# EAGLE design Othello (EAGLE 5.11)

## Sheet 1 of 2
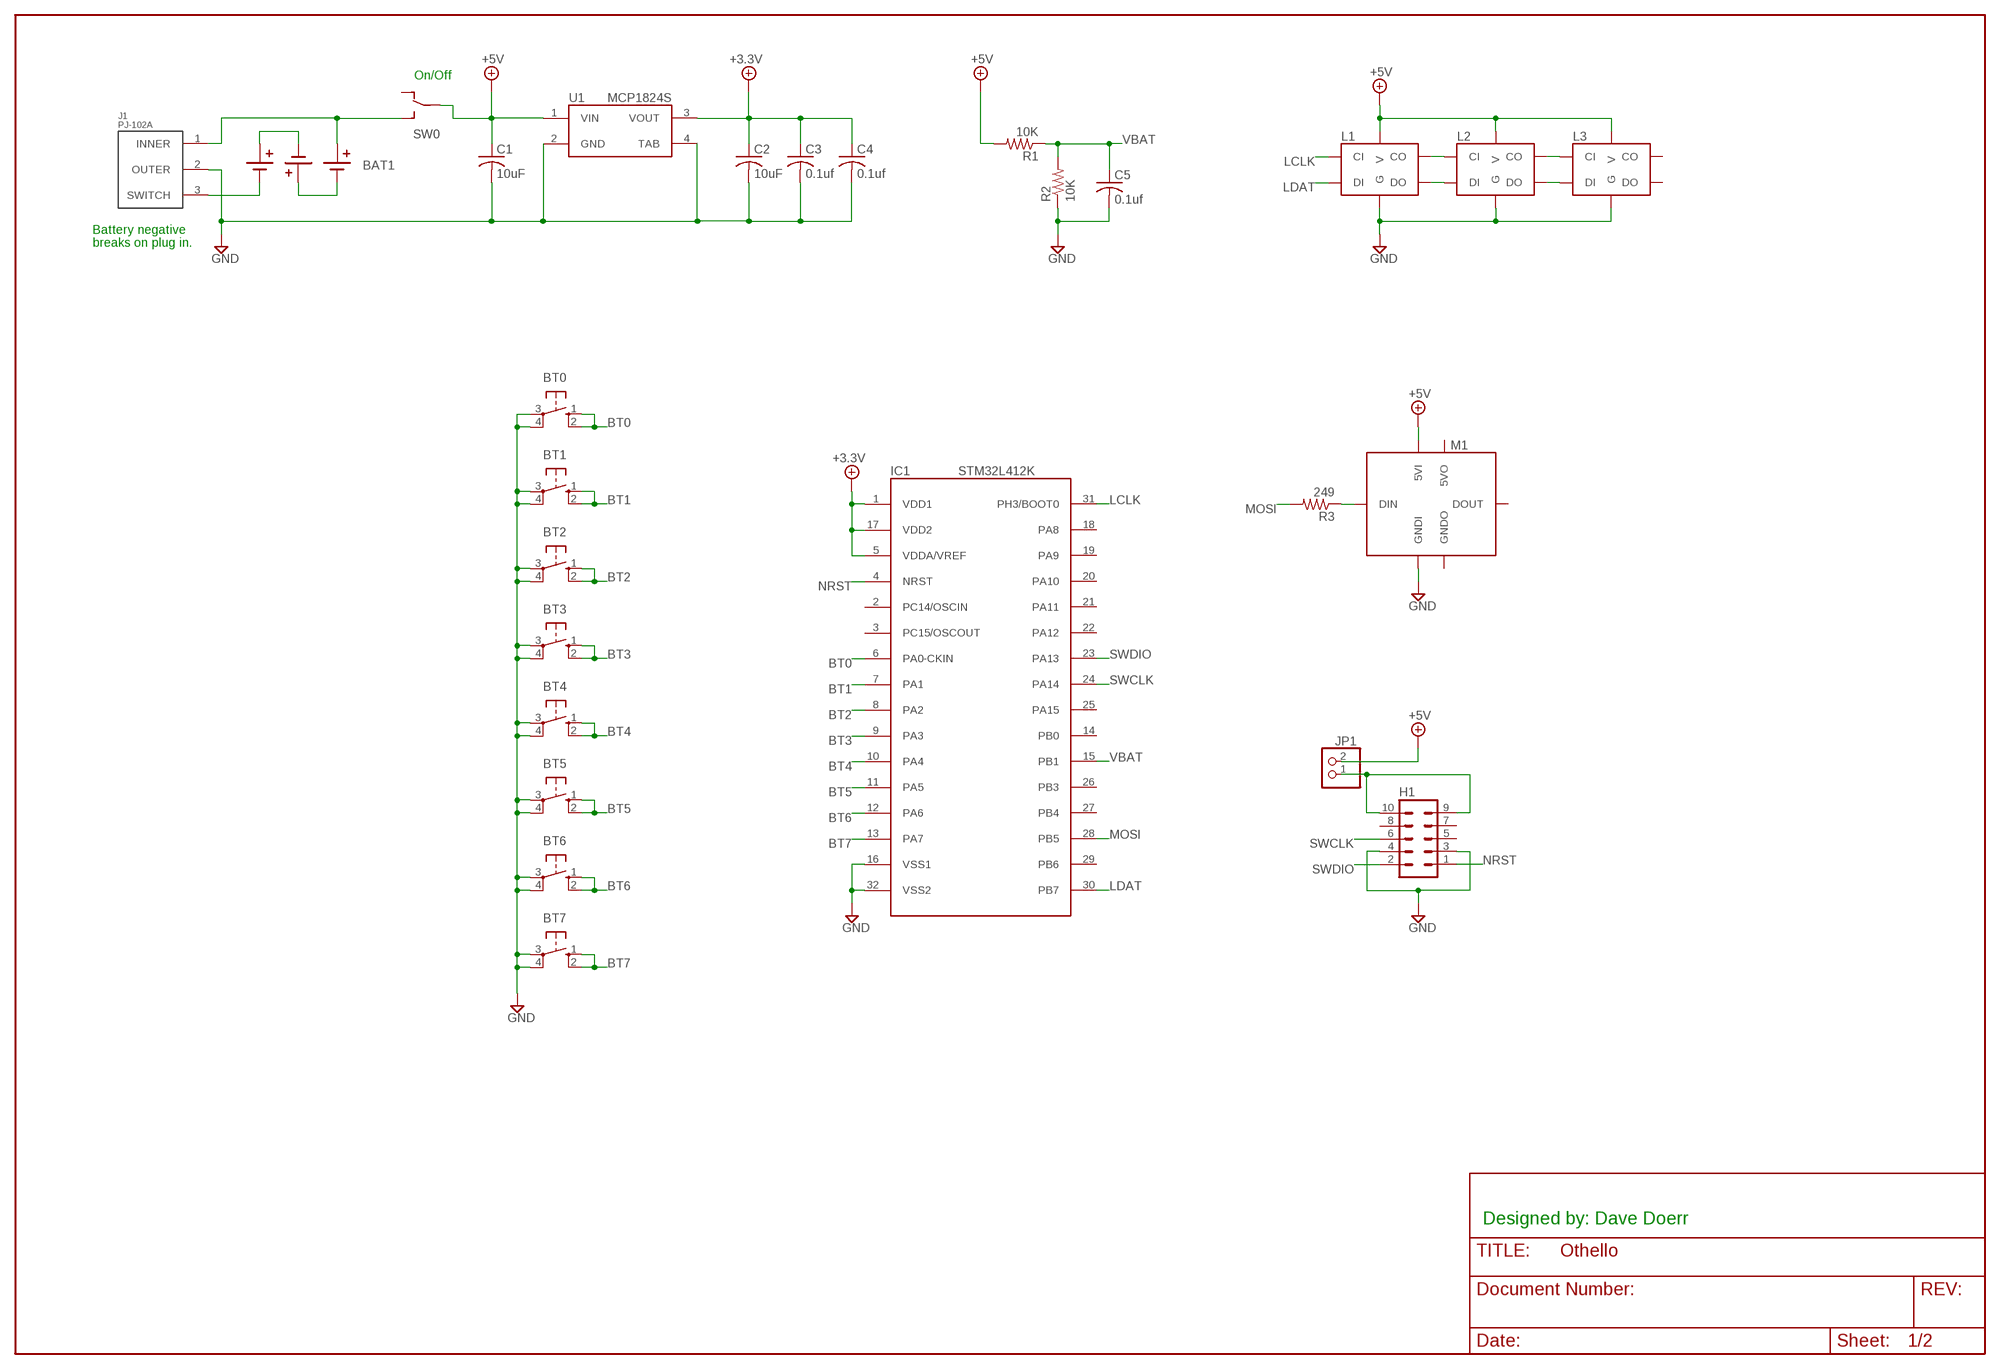
[diagram p0: schematic, sheet 1]

### Parts
BAT1  BATT-3AA-1280  [BATT-3AA-1280]
BT0  SWPB4PINSMG  [SWPB4PINSM]
BT1  SWPB4PINSMG  [SWPB4PINSM]
BT2  SWPB4PINSMG  [SWPB4PINSM]
BT3  SWPB4PINSMG  [SWPB4PINSM]
BT4  SWPB4PINSMG  [SWPB4PINSM]
BT5  SWPB4PINSMG  [SWPB4PINSM]
BT6  SWPB4PINSMG  [SWPB4PINSM]
BT7  SWPB4PINSMG  [SWPB4PINSM]
C1  10uF  C-USC0805  [C0805]
C2  10uF  C-USC0805  [C0805]
C3  0.1uf  C-USC0805  [C0805]
C4  0.1uf  C-USC0805  [C0805]
C5  0.1uf  C-USC0805  [C0805]
H1  FLASH_HDR  [MA05-2]
IC1  STM32L412K  [LQFP32]
J1  PJ-102A  POWER_JACK2  [PJ-102A]
JP1  PINHD-1X2  [1X02]
L1  SK9822  [SK9822]
L2  SK9822  [SK9822]
L3  SK9822  [SK9822]
M1  8X8MATRIX  [8X8MATRIX]
R1  10K  R-US_R0805  [R0805]
R2  10K  R-US_R0805  [R0805]
R3  249  R-US_R0805  [R0805]
SW0  SPDT  [OS102011MS2QN]
U1  MCP1824S  [SOT223]

### Nets
+3.3V [Power]: C2.1 C3.1 C4.1 IC1.1(VDD1) IC1.5(VDDA/VREF) IC1.17(VDD2) U1.3(VOUT)
+5V [Power]: C1.1 JP1.2 L1.P$4(V) L2.P$4(V) L3.P$4(V) M1.P$2(5VI) R1.2 SW0.C U1.1(VIN)
BAT+ [Power]: BAT1.3+ J1.1(INNER) SW0.U
BAT- [Power]: BAT1.1- J1.3(SWITCH)
BT0: BT0.1(S) BT0.2(S1) IC1.6(PA0-CKIN)
BT1: BT1.1(S) BT1.2(S1) IC1.7(PA1)
BT2: BT2.1(S) BT2.2(S1) IC1.8(PA2)
BT3: BT3.1(S) BT3.2(S1) IC1.9(PA3)
BT4: BT4.1(S) BT4.2(S1) IC1.10(PA4)
BT5: BT5.1(S) BT5.2(S1) IC1.11(PA5)
BT6: BT6.1(S) BT6.2(S1) IC1.12(PA6)
BT7: BT7.1(S) BT7.2(S1) IC1.13(PA7)
GND [Power]: BT0.3(P) BT0.4(P1) BT1.3(P) BT1.4(P1) BT2.3(P) BT2.4(P1) BT3.3(P) BT3.4(P1) BT4.3(P) BT4.4(P1) BT5.3(P) BT5.4(P1) BT6.3(P) BT6.4(P1) BT7.3(P) BT7.4(P1) C1.2 C2.2 C3.2 C4.2 C5.2 H1.3 H1.4 IC1.16(VSS1) IC1.32(VSS2) J1.2(OUTER) L1.P$3(G) L2.P$3(G) L3.P$3(G) M1.P$3(GNDI) R2.1 U1.2(GND) U1.4(TAB)
LCLK: IC1.31(PH3/BOOT0) L1.P$2(CI)
LDAT: IC1.30(PB7) L1.P$1(DI)
MOSI: IC1.28(PB5) R3.2
N$1: L1.P$6(DO) L2.P$1(DI)
N$2: L1.P$5(CO) L2.P$2(CI)
N$3: L2.P$6(DO) L3.P$1(DI)
N$4: L2.P$5(CO) L3.P$2(CI)
N$8 [Power]: BAT1.1+ BAT1.2-
N$9 [Power]: BAT1.2+ BAT1.3-
N$11 [Power]: H1.9 H1.10 JP1.1
N$12: M1.P$1(DIN) R3.1
NRST: H1.1 IC1.4(NRST)
SWCLK: H1.6 IC1.24(PA14)
SWDIO: H1.2 IC1.23(PA13)
VBAT: C5.1 IC1.15(PB1) R1.1 R2.2
Unconnected: H1.5 H1.7 H1.8 IC1.2(PC14/OSCIN) IC1.3(PC15/OSCOUT) IC1.14(PB0) IC1.18(PA8) IC1.19(PA9) IC1.20(PA10) IC1.21(PA11) IC1.22(PA12) IC1.25(PA15) IC1.26(PB3) IC1.27(PB4) IC1.29(PB6) L3.P$5(CO) L3.P$6(DO) M1.P$4(GNDO) M1.P$5(5VO) M1.P$6(DOUT) SW0.D

### Notes on the sheet
- On/Off
- Battery negative
- breaks on plug in.
- Designed by: Dave Doerr

## Sheet 2 of 2
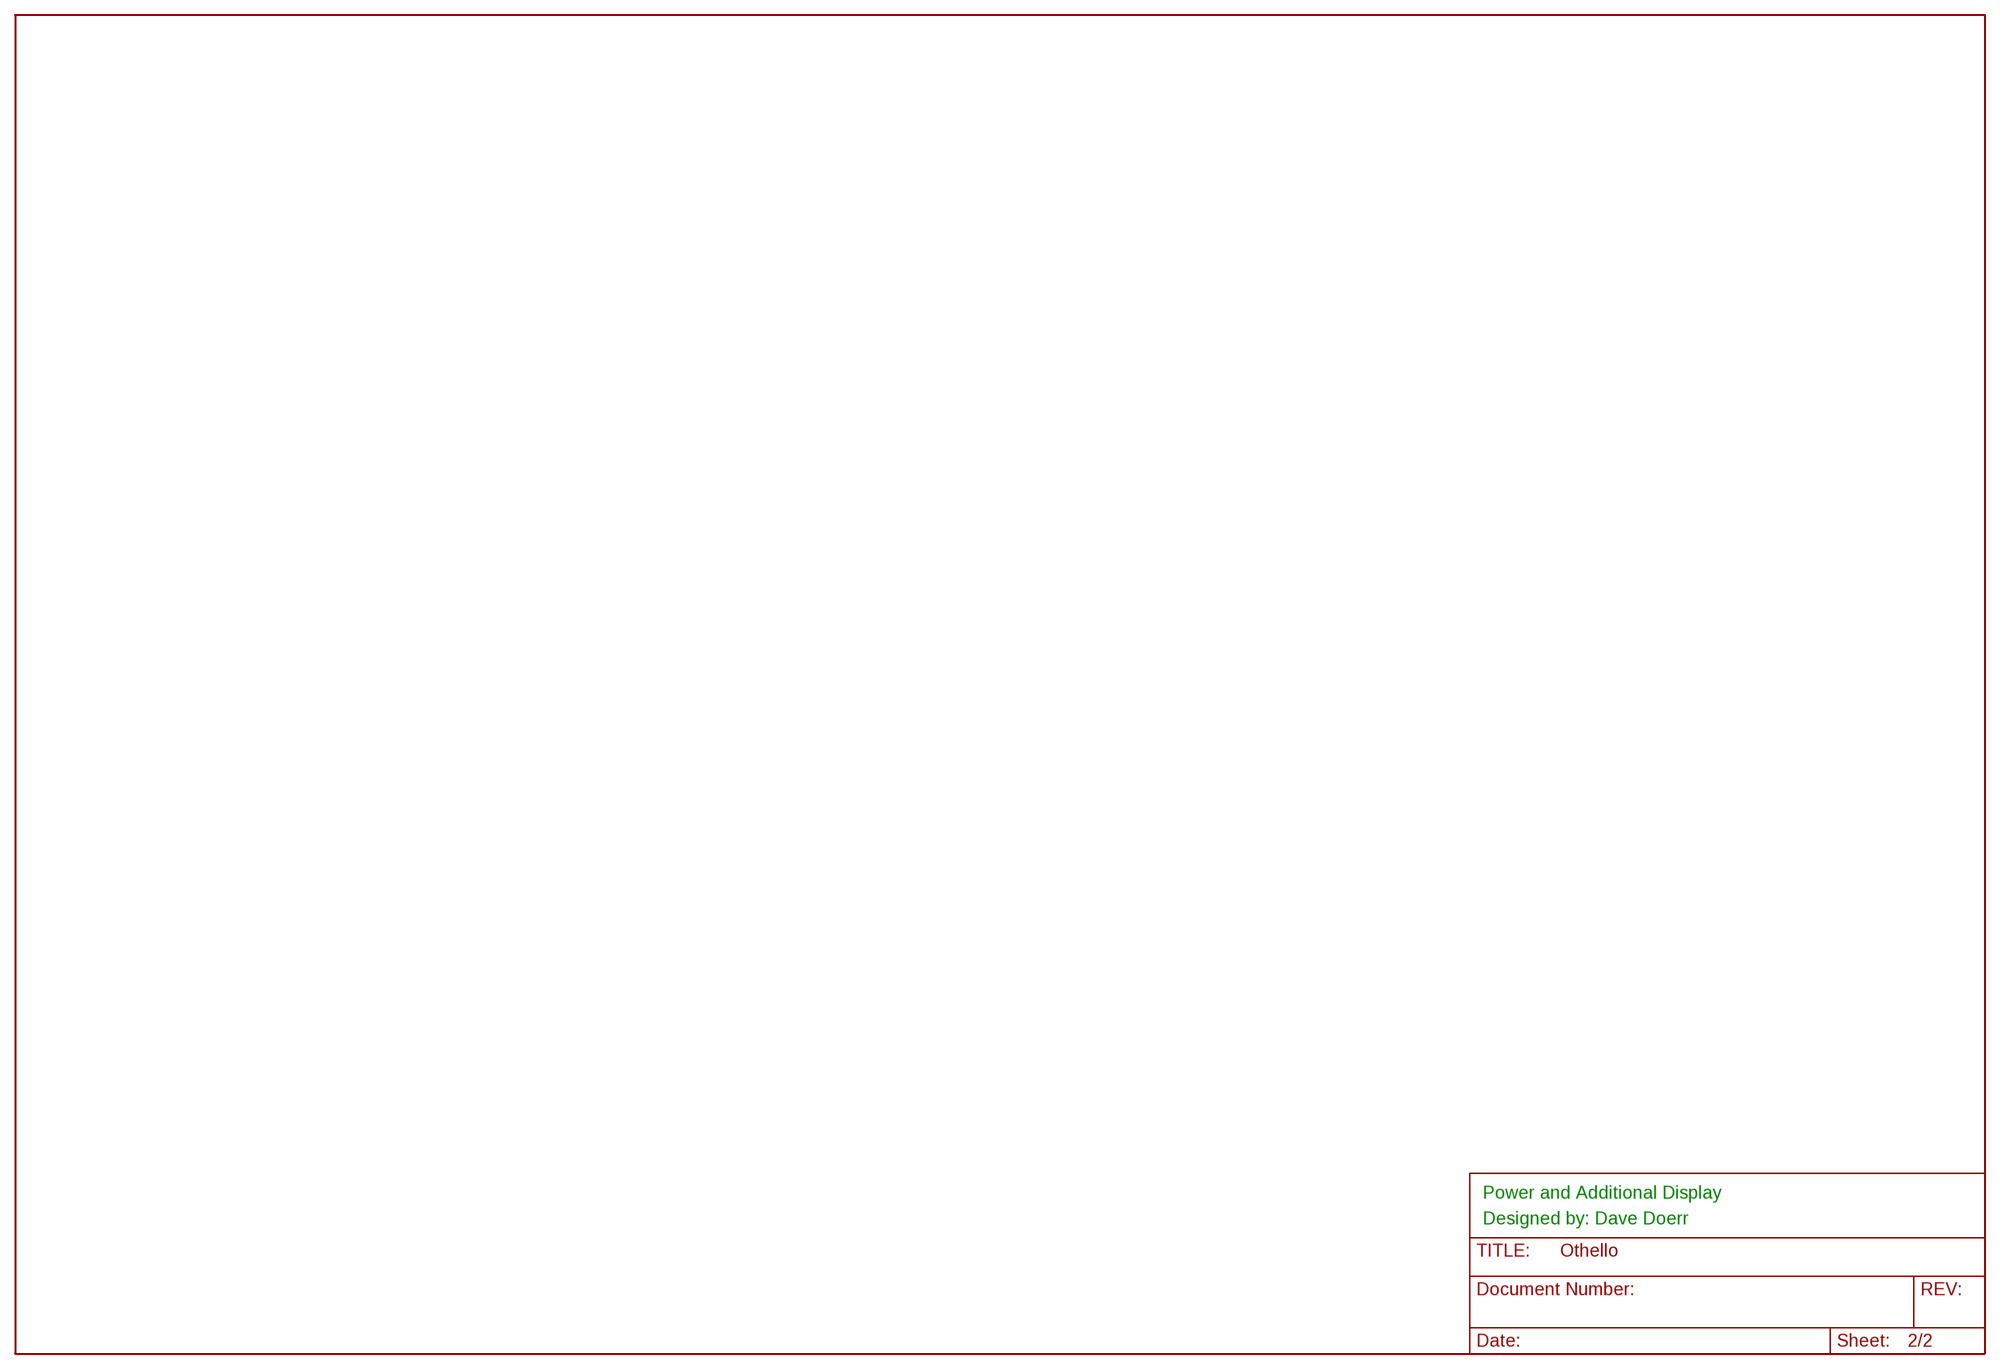
[diagram p1: schematic, sheet 2]

### Notes on the sheet
- Power and Additional Display
- Designed by: Dave Doerr

## Library data of the parts
BAT1 = 0DCD:BATT-3AA-1280: MPD Brand: BK-1280-PC6
BT0 BT1-BT7 = 0DCD:SWPB4PIN: OMRON SWITCH
C1-C5 = rcl:C-US: CAPACITOR, American symbol
H1 = 0DCD:FLASH_HDR: PIN HEADER
IC1 = 0DCD:STM32L412K
J1 = 0DCD:POWER_JACK: 2mm x 5.5mm power jack. This seems to be the most common size. Used on my 5V supplies. Typically, inner is +, outer is ground. Switch is connected to ground when unplugged, and opens on plugging.
JP1 = pinhead:PINHD-1X2: PIN HEADER
L1-L3 = 0DCD:SK9822
M1 = 0DCD:8X8MATRIX: Drill size raise from .04 to .05 to allow for misalignment since I had no datasheet and had to measure.
R1-R3 = rcl:R-US_: RESISTOR, American symbol
SW0 = 0DCD:SPDT: Use OS102011MS2QN1 or N1C which is BBM (break before make). Nice subminiture size but easy to grab and switch
U1 = 0DCD:MCP1824S

## Net classes
0 default: width 0.203 mm, drill 0.203 mm, clearance 0.203 mm
1 Power: width 0.508 mm, drill 0.203 mm, clearance 0.203 mm
2 ACin: width 1.27 mm, drill 1.27 mm, clearance 0.635 mm
3 SmallContacts: width 1.27 mm
4 RegDC: width 0.635 mm
5 GND: width 1.27 mm
6 HighDC: width 1.27 mm

## Board
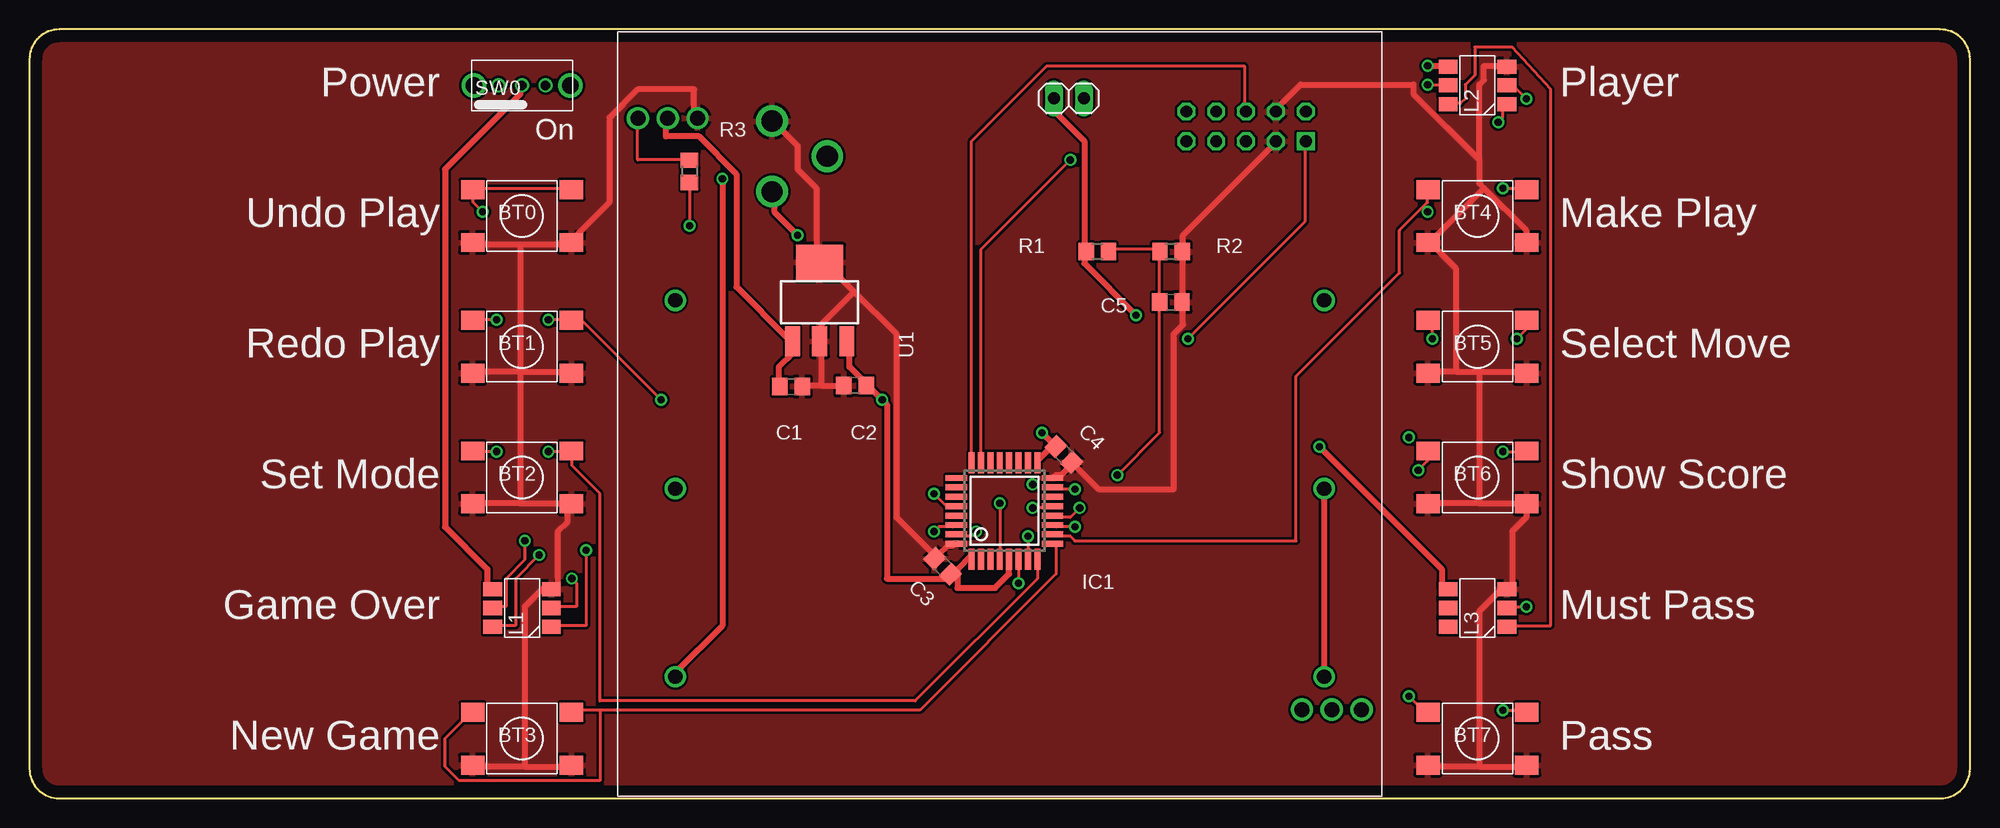
[diagram p2: board, top side]
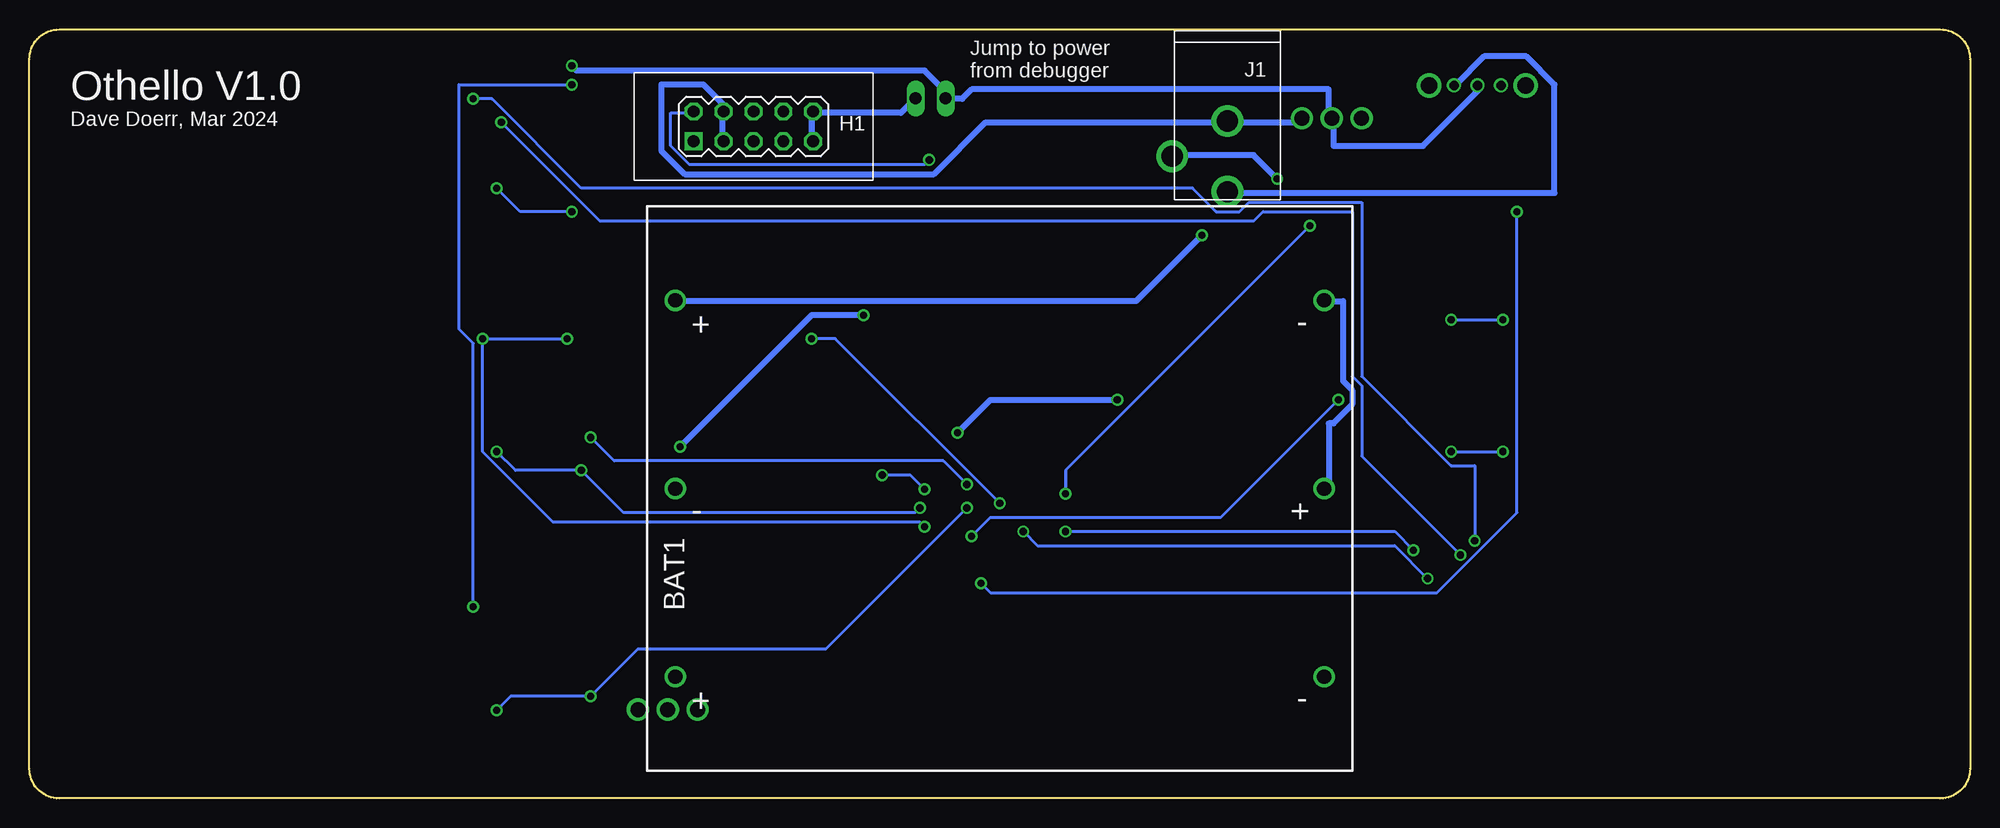
[diagram p3: board, bottom side, seen from below]

Size 165.1 x 65.41 mm. Coordinates in mm from the lower left corner, seen from the top.
Outline: 165.1,62.87 arc90 162.56,65.41 2.54,65.41 arc90 0,62.87 0,2.54 arc90 2.54,0 162.56,0 arc90 165.1,2.54 165.1,62.87
Copper layers (1*16): Top 0.035mm / dielectric 1.5mm / Bottom 0.035mm
Design rules "default *": minimum track width 10mil, minimum drill 24mil, track to track 8mil, track to pad 8mil, pad to pad 8mil, via to via 8mil, smd to smd 8mil, copper to edge 40mil, drill to drill 8mil, minimum pad ring 8mil, minimum via ring 8mil, stop-mask expansion 4mil, vias tented up to drill 0mil, thermal gap 10mil

### Footprints (pad centres in the part's own frame; a part is rotated, then mirrored left to right if it is on the bottom)
BATT-3AA-1280 = drill 1.2 round: 1+ -27.6,-16; 1- 27.6,-16; 2+ 27.6,0; 2- -27.6,0; 3+ -27.6,16; 3- 27.6,16
SWPB4PINSM = smd 2 x 1.6: 1 -4.2,2.25; 2 4.2,2.25; 3 -4.2,-2.25; 4 4.2,-2.25
C0805 = smd 1.3 x 1.5: 1 -0.95,0; 2 0.95,0
MA05-2 = drill 1.016 square: 1 -5.08,-1.27 | drill 1.016 octagon: 2 -5.08,1.27; 3 -2.54,-1.27; 4 -2.54,1.27; 5 0,-1.27; 6 0,1.27; 7 2.54,-1.27; 8 2.54,1.27; 9 5.08,-1.27; 10 5.08,1.27
LQFP32 = smd 0.5 x 1.8: 1 -2.8,-4.1; 2 -2,-4.1; 3 -1.2,-4.1; 4 -0.4,-4.1; 5 0.4,-4.1; 6 1.2,-4.1; 7 2,-4.1; 8 2.8,-4.1; 17 2.8,4.1; 18 2,4.1; 19 1.2,4.1; 20 0.4,4.1; 21 -0.4,4.1; 22 -1.2,4.1; 23 -2,4.1; 24 -2.8,4.1 | smd 1.8 x 0.5: 9 4.1,-2.8; 10 4.1,-2; 11 4.1,-1.2; 12 4.1,-0.4; 13 4.1,0.4; 14 4.1,1.2; 15 4.1,2; 16 4.1,2.8; 25 -4.1,2.8; 26 -4.1,2; 27 -4.1,1.2; 28 -4.1,0.4; 29 -4.1,-0.4; 30 -4.1,-1.2; 31 -4.1,-2; 32 -4.1,-2.8
PJ-102A = drill 1.8 round: 1 0,3; 2 0,-3; 3 4.7,0
1X02 = drill 1.016 long: 1 -1.27,0; 2 1.27,0
SK9822 = smd 1.6 x 1.2: P$1 2.5,-1.6; P$2 2.5,0; P$3 2.5,1.6; P$4 -2.5,1.6; P$5 -2.5,0; P$6 -2.5,-1.6
8X8MATRIX = drill 1.27 round: P$1 -30.785,25.146; P$2 -28.245,25.146; P$3 -25.705,25.146; P$4 25.705,-25.146; P$5 28.245,-25.146; P$6 30.785,-25.146
R0805 = smd 1.3 x 1.5: 1 -0.95,0; 2 0.95,0
OS102011MS2QN = drill 0.8 round: C 0,0; D 0,-2; U 0,2 | drill 1.4 round: P$4 0,4.1; P$5 0,-4.1
SOT223 = smd 1.27 x 2.54: 1 -2.311,-3.302; 2 0,-3.302; 3 2.311,-3.302 | smd 4 x 3: 4 0,3.4

### Placement (x,y rotation side)
BAT1  82.55,26.35 0 bottom
BT0  41.91,49.53 0 top
BT1  41.91,38.42 0 top
BT2  41.91,27.3 0 top
BT3  41.91,5.08 0 top
BT4  123.19,49.53 0 top
BT5  123.19,38.42 0 top
BT6  123.19,27.3 0 top
BT7  123.19,5.08 0 top
C1  64.8,35.04 0 top
C2  70.24,35.11 180 top
C3  77.69,19.73 135 top
C4  88,29.26 315 top
C5  97.11,42.22 0 top
H1  103.5,57.15 0 bottom
IC1  82.95,24.45 0 top
J1  63.18,54.61 180 bottom
JP1  88.43,59.54 180 top
L1  41.91,16.19 0 top
L2  123.19,60.64 0 top
L3  123.19,16.19 0 top
M1  82.55,32.7 0 top
R1  90.85,46.51 180 top
R2  97.12,46.51 180 top
R3  56.15,53.33 270 top
SW0  41.91,60.64 270 top
U1  67.23,42.19 0 top

### Tracks (layer width: path | path; a pad name or v marks a point on that pad's centre or on a via)
+3.3V  (via drill 0.61)
  Top 0.508: 78.95,19.5 80.15,20.7 IC1.1 | 78.95,19.5 78.55,19.1 C3.1 | 78.95,19.5 78.95,17.9 82.15,17.9 83.35,19.1 IC1.5 | C3.1 78.95,19.5 | IC1.17 85.75,28.7 86.95,29.9 C4.1 v86.15,31.1 | U1.3 69.75,38.7 69.75,36.7 70.95,35.5 C2.1 71.35,35.1 v72.55,33.9 72.95,33.5 72.95,18.7 78.15,18.7 C3.1
  Bottom 0.508: v86.15,31.1 83.35,33.9 v72.55,33.9
+5V  (via drill 0.61)
  Top 0.508: C1.1 63.75,35.1 63.75,36.7 64.95,37.9 64.95,38.7 U1.1 64.55,39.1 60.15,43.5 60.15,53.1 56.95,56.3 54.15,56.3 54.15,57.5 M1.P$2 | L1.P$4 39.35,17.9 38.95,17.9 38.95,19.5 35.35,23.1 35.35,53.5 41.75,59.9 41.75,60.3 SW0.C | JP1.2 87.35,59.5 87.35,58.3 89.75,55.9 89.75,46.7 R1.2 89.75,46.3 89.75,45.5 v94.15,41.1 | v109.75,29.9 120.15,19.5 120.15,17.9 120.55,17.9 L3.P$4 | v118.95,62.3 120.55,62.3 L2.P$4
  Bottom 0.508: SW0.C 41.75,60.3 46.55,55.5 54.15,55.5 54.15,57.5 M1.P$2 54.55,57.9 54.55,60.3 84.95,60.3 85.75,59.5 86.95,59.5 JP1.2 86.95,59.9 88.95,61.9 118.55,61.9 v118.95,62.3 | v109.75,29.9 98.55,41.1 v94.15,41.1
BAT+  (via drill 0.61)
  Top 0.508: v65.35,47.9 63.35,49.9 63.35,51.5 J1.1
  Bottom 0.508: SW0.U 43.75,60.7 41.35,63.1 37.75,63.1 35.35,60.7 35.35,51.5 62.95,51.5 J1.1 | v65.35,47.9 70.95,42.3 110.15,42.3 BAT1.3+
BAT-  (via drill 0.61)
  Top 0.508: v58.95,52.7 58.95,14.7 54.95,10.7 BAT1.1-
  Bottom 0.508: v58.95,52.7 60.95,54.7 67.75,54.7 J1.3
BT0  (via drill 0.61)
  Top 0.254: v38.55,49.9 37.75,50.7 37.75,51.5 BT0.1 37.75,51.9 45.75,51.9 BT0.2 | IC1.6 v84.15,18.3
  Bottom 0.254: v84.15,18.3 83.35,17.5 45.35,17.5 38.55,24.3 v38.55,49.9
BT1  (via drill 0.61)
  Top 0.254: v53.75,33.9 46.95,40.7 46.15,40.7 BT1.2 45.75,40.7 v44.15,40.7 | v84.95,22.3 IC1.7 | v39.75,40.7 37.75,40.7 BT1.1
  Bottom 0.254: v84.95,22.3 83.35,23.9 63.75,23.9 v53.75,33.9 | v44.15,40.7 v39.75,40.7
BT2  (via drill 0.61)
  Top 0.254: IC1.8 85.75,18.7 75.35,8.3 48.55,8.3 48.55,25.9 46.15,28.3 46.15,29.5 BT2.2 45.75,29.5 v44.15,29.5 | v39.75,29.5 37.75,29.5 BT2.1
  Bottom 0.254: v44.15,29.5 v39.75,29.5
BT3
  Top 0.254: 48.55,7.5 46.15,7.5 BT3.2 | 48.55,7.5 75.75,7.5 87.35,19.1 87.35,21.5 IC1.9 | 48.55,7.5 48.55,1.5 36.55,1.5 35.35,2.7 35.35,5.1 37.35,7.1 BT3.1
BT4  (via drill 0.61)
  Top 0.254: 118.55,50.3 118.95,50.7 118.95,51.5 BT4.1 | 118.55,50.3 116.55,48.3 116.55,44.7 107.75,35.9 107.75,21.9 88.95,21.9 88.55,22.3 87.35,22.3 IC1.10 | v125.35,51.9 127.35,51.9 BT4.2 | 118.55,50.3 v118.95,49.9
  Bottom 0.254: v125.35,51.9 123.35,49.9 v118.95,49.9
BT5  (via drill 0.61)
  Top 0.254: v88.95,23.1 87.35,23.1 IC1.11 | v126.55,39.1 127.35,39.9 127.35,40.3 BT5.2 | v119.35,39.1 119.35,40.3 BT5.1
  Bottom 0.254: v88.95,23.1 89.35,23.5 120.55,23.5 126.55,29.5 v126.55,39.1 v119.35,39.1
BT6  (via drill 0.61)
  Top 0.254: v89.35,24.7 88.55,23.9 87.35,23.9 IC1.12 | v118.15,27.9 118.95,28.7 118.95,29.5 BT6.1 | v125.35,29.5 127.35,29.5 BT6.2
  Bottom 0.254: v89.35,24.7 89.75,24.3 114.55,24.3 v118.15,27.9 123.75,27.9 v125.35,29.5
BT7  (via drill 0.61)
  Top 0.254: v85.35,24.7 86.95,24.7 IC1.13 | v117.35,8.7 118.95,7.1 BT7.1 | v125.35,7.5 127.35,7.5 BT7.2
  Bottom 0.254: v85.35,24.7 97.35,12.7 113.35,12.7 v117.35,8.7 124.15,8.7 v125.35,7.5
GND
  Top 0.508: 41.75,36.3 45.75,36.3 BT1.4 | 41.75,36.3 37.75,36.3 BT1.3 | 41.75,47.1 45.75,47.1 BT0.4 46.15,47.5 49.35,50.7 49.35,57.9 51.75,60.3 56.55,60.3 56.55,57.9 M1.P$3 | 41.75,47.1 37.75,47.1 BT0.3 | 41.75,47.1 41.75,36.3 | 42.15,2.7 45.75,2.7 BT3.4 | 42.15,2.7 37.75,2.7 BT3.3 | 41.75,25.1 45.75,25.1 BT2.4 45.75,24.7 45.75,23.5 44.95,22.7 44.95,17.9 44.55,17.9 L1.P$3 44.15,17.9 43.75,17.9 42.15,16.3 42.15,2.7 | 41.75,25.1 37.75,25.1 BT2.3 | 41.75,36.3 41.75,25.1 | 67.35,35.1 68.95,35.1 C2.2 | 67.35,35.1 65.75,35.1 C1.2 | 67.35,35.1 67.35,38.7 U1.2 67.35,39.1 67.35,40.3 70.15,43.1 | IC1.32 78.55,21.5 78.15,21.5 77.35,20.7 C3.2 76.95,20.7 73.75,23.9 73.75,39.5 70.15,43.1 | 70.15,43.1 67.35,45.9 U1.4 66.95,45.9 66.95,51.9 65.35,53.5 65.35,55.5 63.35,57.5 J1.2 | IC1.16 87.35,27.5 87.75,27.5 88.55,28.3 C4.2 90.95,26.3 97.35,26.3 97.35,39.5 98.15,40.3 98.15,41.9 C5.2 98.15,42.3 98.15,46.3 R2.1 98.15,46.7 98.15,47.9 105.75,55.5 H1.3 | 123.35,54.3 123.35,52.3 123.75,51.9 | 123.35,54.3 123.35,60.7 123.75,61.1 123.75,62.3 125.35,62.3 L2.P$3 | 123.75,51.9 127.35,48.3 127.35,47.5 BT4.4 | 123.75,51.9 119.35,47.5 BT4.3 119.35,47.1 121.35,45.1 121.35,36.3 | 123.35,36.3 127.35,36.3 BT5.4 | 121.35,36.3 123.35,36.3 | 121.35,36.3 119.35,36.3 BT5.3 | 123.35,2.7 127.35,2.7 BT7.4 | 123.35,2.7 119.35,2.7 BT7.3 | 123.35,25.1 127.35,25.1 BT6.4 127.35,24.7 127.35,23.9 126.15,22.7 126.15,17.9 125.75,17.9 L3.P$3 125.35,17.9 123.35,15.9 123.35,2.7 | 123.35,25.1 119.35,25.1 BT6.3 | 123.35,36.3 123.35,25.1 | 123.35,54.3 117.75,59.9 117.75,60.7 108.15,60.7 106.15,58.7 H1.4
  Bottom 0.508: M1.P$3 56.95,57.5 62.95,57.5 J1.2 63.35,57.5 83.75,57.5 88.15,53.1 109.35,53.1 111.35,55.1 111.35,60.7 107.75,60.7 105.75,58.7 H1.4 106.15,58.3 106.15,55.9 H1.3
  pour Top: 3.19,0.62 arc-90 0.65,3.16 0.65,62.25 arc-90 3.19,64.78 161.91,64.78 arc-90 164.45,62.25 164.45,3.16 arc-90 161.91,0.62
LCLK  (via drill 0.61)
  Top 0.254: v46.15,18.7 46.55,18.3 46.55,16.3 44.55,16.3 L1.P$2 | v80.55,22.7 80.15,22.3 78.95,22.3 IC1.31
  Bottom 0.254: v46.15,18.7 48.95,21.5 79.35,21.5 v80.55,22.7
LDAT  (via drill 0.61)
  Top 0.254: v47.35,21.1 47.35,14.7 44.55,14.7 L1.P$1 | v76.95,22.7 77.35,23.1 78.55,23.1 IC1.30
  Bottom 0.254: v47.35,21.1 48.95,22.7 v76.95,22.7
MOSI  (via drill 0.61)
  Top 0.254: v56.15,48.7 56.15,52.3 R3.2 | v76.95,25.9 78.15,24.7 78.55,24.7 IC1.28
  Bottom 0.254: v56.15,48.7 76.95,27.9 v76.95,25.9
N$1  (via drill 0.61)
  Top 0.254: v43.35,20.7 41.35,18.7 41.35,14.7 39.75,14.7 L1.P$6 | v124.95,57.5 125.35,57.9 125.35,58.7 L2.P$1
  Bottom 0.254: v43.35,20.7 51.75,29.1 51.75,35.1 52.55,35.9 52.55,49.9 60.15,49.9 60.95,49.1 116.55,49.1 v124.95,57.5
N$2  (via drill 0.61)
  Top 0.254: v42.15,21.9 42.15,20.3 40.55,18.7 40.55,16.3 39.75,16.3 L1.P$5 | v127.35,59.5 126.15,60.7 125.75,60.7 L2.P$2
  Bottom 0.254: v42.15,21.9 42.15,28.3 44.15,28.3 51.75,35.9 51.75,50.7 61.35,50.7 62.15,49.9 64.15,49.9 66.15,51.9 118.15,51.9 125.75,59.5 v127.35,59.5
N$3
  Top 0.254: L3.P$1 125.75,14.7 129.43,14.7 129.43,60.3 126.15,63.9 122.95,63.9 122.95,61.5 122.15,60.7 122.15,59.5 121.75,59.1 120.95,59.1 L2.P$6
N$4  (via drill 0.61)
  Top 0.254: v127.35,16.3 125.75,16.3 L3.P$2 | v118.95,60.7 120.55,60.7 L2.P$5
  Bottom 0.254: v127.35,16.3 127.35,38.7 128.55,39.9 128.55,60.7 v118.95,60.7
N$8
  Top 0.508: BAT1.1+ BAT1.2-
N$9
  Bottom 0.508: BAT1.2+ 54.55,26.7 54.55,31.9 54.15,31.9 52.55,33.5 52.55,34.7 53.35,35.5 53.35,42.3 54.55,42.3 BAT1.3-
N$11
  Bottom 0.508: JP1.1 89.75,59.5 90.95,58.3 98.15,58.3 H1.10 98.55,58.3 98.55,55.9 H1.9
N$12
  Top 0.254: R3.1 56.15,54.3 51.75,54.3 51.75,57.5 M1.P$1
NRST  (via drill 0.61)
  Top 0.254: v98.55,39.1 108.55,49.1 108.55,55.5 H1.1 | v82.55,25.1 IC1.4
  Bottom 0.254: v82.55,25.1 96.55,39.1 v98.55,39.1
PH  (via drill 0.61)
  Bottom 0.254: v117.35,30.7 115.35,28.7 87.35,28.7 v85.35,26.7
SWCLK
  Top 0.254: IC1.24 80.15,55.9 86.55,62.3 103.35,62.3 103.35,58.7 H1.6
SWDIO  (via drill 0.61)
  Top 0.254: v88.55,54.3 80.95,46.7 IC1.23
  Bottom 0.254: v88.55,54.3 88.95,53.9 108.95,53.9 110.55,55.5 110.55,58.3 108.95,58.3 H1.2
VBAT  (via drill 0.61)
  Top 0.254: R1.1 92.15,46.7 96.15,46.7 R2.2 96.15,46.3 96.15,42.3 C5.1 96.15,41.9 96.15,31.1 v92.55,27.5 | v88.95,26.3 87.35,26.3 IC1.15
  Bottom 0.254: v88.95,26.3 90.15,27.5 v92.55,27.5

### Text on the board
tPlace: Power | Player | On | Undo Play | Make Play | Redo Play | Select Move | Set Mode | Show Score | Game Over | Must Pass | New Game | Pass
bPlace: Jump to power | from debugger | Othello V1.0 | Dave Doerr, Mar 2024